# EAGLE design Adafruit I2C FRAM (EAGLE 6.3)
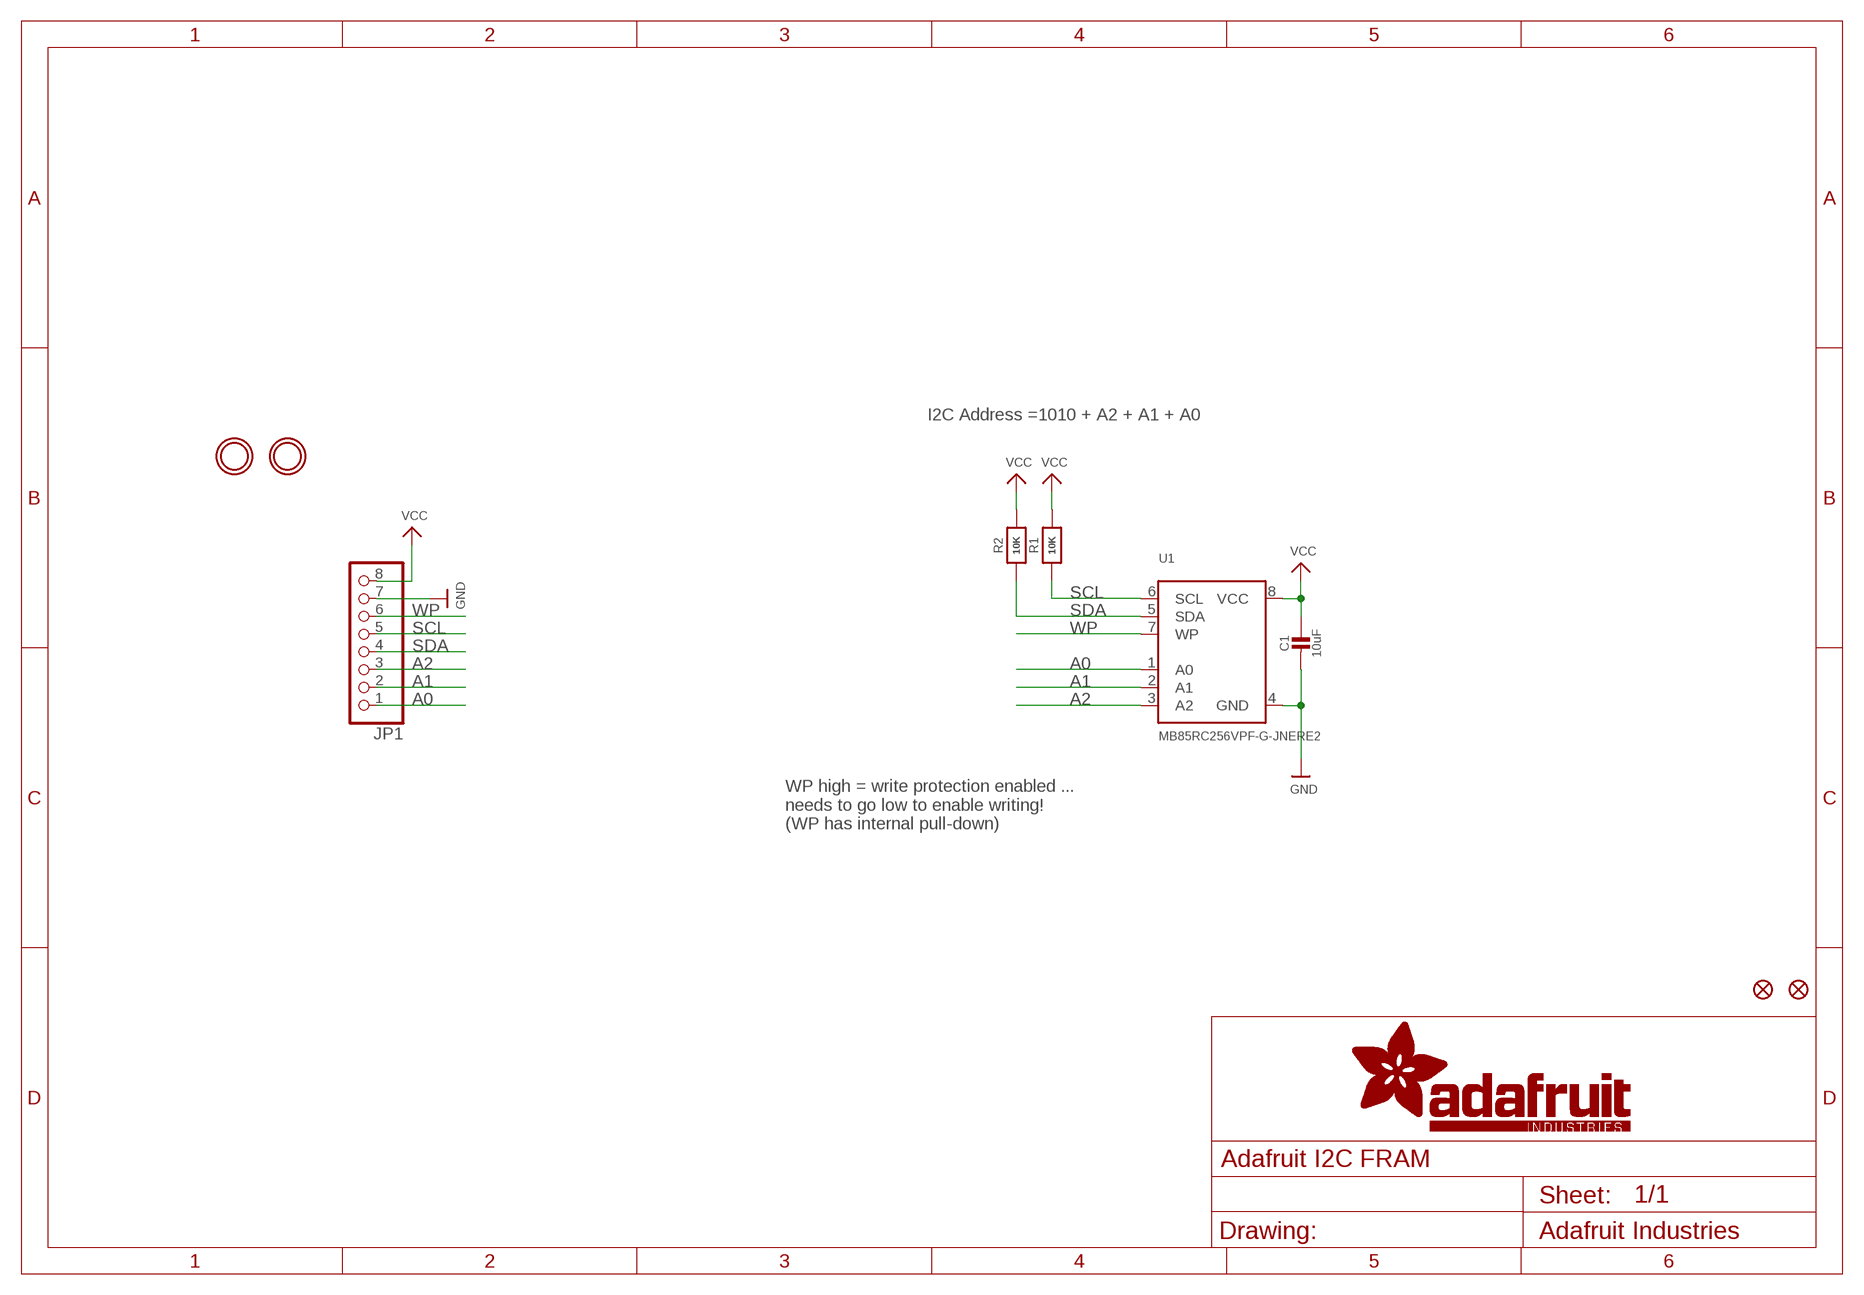
[diagram p0: schematic, sheet 1]

## Parts
C1  10uF  CAP_CERAMIC_0805MP  [_0805MP]
FID1  FIDUCIAL""  [FIDUCIAL_1MM]
FID2  FIDUCIAL""  [FIDUCIAL_1MM]
JP1  HEADER-1X870MIL  [1X08_ROUND_70]
R1  10K  RESISTOR_0805MP  [_0805MP]
R2  10K  RESISTOR_0805MP  [_0805MP]
U1  MB85RC256VPF-G-JNERE2  FRAM_SOIC8_I2C  [SOIC8_208MIL]
U$5  MOUNTINGHOLE2.5  [MOUNTINGHOLE_2.5_PLATED]
U$6  MOUNTINGHOLE2.5  [MOUNTINGHOLE_2.5_PLATED]

## Nets
A0: JP1.1 U1.1(A0)
A1: JP1.2 U1.2(A1)
A2: JP1.3 U1.3(A2)
GND: C1.2 JP1.7 U1.4(GND)
SCL: JP1.5 R1.1 U1.6(SCL)
SDA: JP1.4 R2.1 U1.5(SDA)
VCC: C1.1 JP1.8 R1.2 R2.2 U1.8(VCC)
WP: JP1.6 U1.7(WP)

## Notes on the sheet
- I2C Address =1010 + A2 + A1 + A0
- WP high = write protection enabled ... 
  needs to go low to enable writing!  
  (WP has internal pull-down)

## Library data of the parts
C1 = microbuilder:CAP_CERAMIC: Ceramic Capacitors For new designs, use the packages preceded by an '_' character since they are more reliable: The following footprints should be used on most boards: _0402 - Standard footprint for regular board layouts _0603 - Standard footprint for regular board layouts _0805 - Standard footprint for regular board layouts _1206 - Standard footprint for regular board layouts For extremely tight-pitch boards where space is at a premium, the following 'micro-pitch' footprints can be used (smaller pads, no silkscreen outline, etc.): _0402MP - Micro-pitch footprint for very dense/compact boards _0603MP - Micro-pitch footprint for very dense/compact boards _0805MP - Micro-pitch footprint for very dense/compact boards _1206MP - Micro-pitch footprint for very dense/compact boards
FID1 FID2 = microbuilder:FIDUCIAL: Fiducial Alignment Points Various fiducial points for machine vision alignment.; BOM: EXCLUDE
JP1 = microbuilder:HEADER-1X8: PIN HEADER
R1 R2 = microbuilder:RESISTOR: Resistors For new designs, use the packages preceded by an '_' character since they are more reliable: The following footprints should be used on most boards: _0402 - Standard footprint for regular board layouts _0603 - Standard footprint for regular board layouts _0805 - Standard footprint for regular board layouts _1206 - Standard footprint for regular board layouts For extremely tight-pitch boards where space is at a premium, the following 'micro-pitch' footprints can be used (smaller pads, no silkscreen outline, etc.): _0402MP - Micro-pitch footprint for very dense/compact boards _0603MP - Micro-pitch footprint for very dense/compact boards _0805MP - Micro-pitch footprint for very dense/compact boards _1206MP - Micro-pitch footprint for very dense/compact boards
U1 = microbuilder:FRAM_SOIC8_I2C: I2C FRAM - SOIC8 Package 256KBit (32Kx8) - MB85RC256VPF-G-JNERE2 - SOIC-8 200 Mil, 2.7-5.5V, -40°C-85°C
U$5 U$6 = microbuilder:MOUNTINGHOLE: Mounting Hole For #2 screws (0.086"/2.18mm width, 0.094"/2.4mm hole) use 2.5mm; BOM: EXCLUDE

## Board
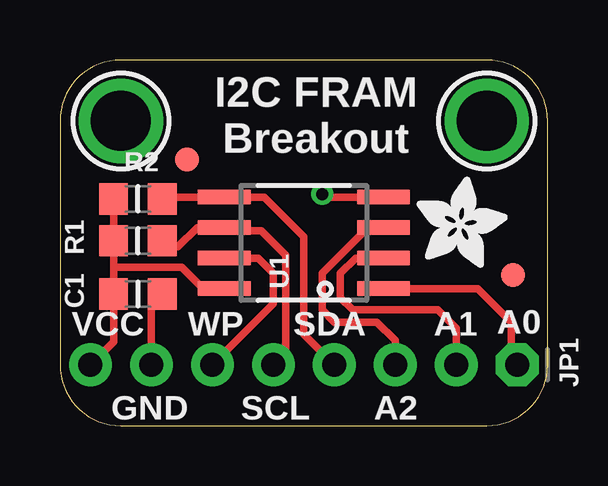
[diagram p1: board, top side]
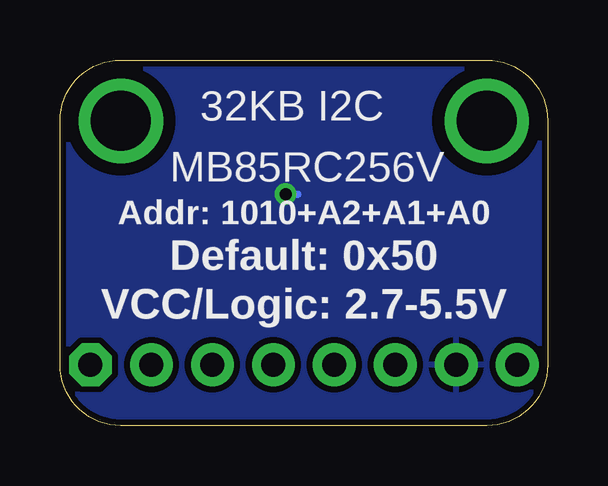
[diagram p2: board, bottom side, seen from below]

Size 20.32 x 15.24 mm. Coordinates in mm from the lower left corner, seen from the top.
Outline: 0,12.7 0,2.54 arc90 2.54,0 17.78,0 arc90 20.32,2.54 20.32,12.7 arc90 17.78,15.24 2.54,15.24 arc90 0,12.7
Copper layers (1*16): Top 0.035mm / dielectric 1.5mm / Bottom 0.035mm
Design rules "adafruit": minimum track width 8mil, minimum drill 15.5mil, track to track 8mil, track to pad 8mil, pad to pad 8mil, via to via 8mil, smd to smd 8mil, copper to edge 10mil, drill to drill 8mil, minimum pad ring 10mil, minimum via ring 8mil, stop-mask expansion 4mil, vias tented up to drill 20mil, thermal gap 10mil

### Footprints (pad centres in the part's own frame; a part is rotated, then mirrored left to right if it is on the bottom)
_0805MP = smd 1.2 x 1.3: 1 -1.016,0; 2 1.016,0
FIDUCIAL_1MM = smd 1 x 1: 1 0,0
1X08_ROUND_70 = drill 1 pad 1.778 octagon: 1 -8.89,0 | drill 1 pad 1.778: 2 -6.35,0; 3 -3.81,0; 4 -1.27,0; 5 1.27,0; 6 3.81,0; 7 6.35,0; 8 8.89,0
SOIC8_208MIL = smd 0.6 x 2.2: 1 -1.905,-3.315; 2 -0.635,-3.315; 3 0.635,-3.315; 4 1.905,-3.315; 5 1.905,3.315; 6 0.635,3.315; 7 -0.635,3.315; 8 -1.905,3.315
MOUNTINGHOLE_2.5_PLATED = drill 2.5 pad 3.2: P$1 0,0

### Placement (x,y rotation side)
C1  3.25,5.49 0 top
FID1  5.29,11.1 0 top
FID2  18.88,6.28 0 top
JP1  10.16,2.54 180 top
R1  3.25,7.71 180 top
R2  3.25,9.45 180 top
U1  10.16,7.62 90 top
U$4  [ADAFRUIT_3.5MM]  14.85,6.57 0 top
U$5  2.54,12.7 0 top
U$6  17.78,12.7 0 top

### Tracks (layer width: path | path; a pad name or v marks a point on that pad's centre or on a via)
A0
  Top 0.305: U1.1 17.4,5.71 18.8,4.32 18.8,2.79 JP1.1
A1
  Top 0.305: U1.2 12.32,6.99 11.68,6.35 11.68,5.33 12.19,4.83 15.75,4.83 16.51,4.06 JP1.2
A2
  Top 0.305: U1.3 12.83,8.26 10.92,6.35 10.92,4.83 11.43,4.32 13.21,4.32 13.97,3.56 JP1.3
GND  (via drill 0.5)
  Top 0.305: C1.2 3.81,5.04 JP1.7 | U1.4 11.05,9.53 v10.92,9.65
  Bottom 0.305: v10.92,9.65 10.41,9.65
  pour Bottom (isolate 0.254): 0,16.27 20.21,16.27 20.21,0 0,0
SCL
  Top 0.305: R1.1 4.91,7.45 5.71,8.26 U1.6 6.97,8.13 8.38,8.13 9.4,7.11 9.4,3.05 JP1.5
SDA
  Top 0.305: R2.1 4.26,9.53 U1.5 8.51,9.53 10.16,7.87 10.16,3.81 JP1.4
VCC
  Top 0.305: R2.2 R1.2 2.23,6.6 | 2.23,6.6 C1.1 2.23,3.5 JP1.8 | U1.8 5.97,5.71 5.08,6.6 2.23,6.6
WP
  Top 0.305: JP1.6 8.89,5.08 8.89,6.35 8.26,6.99 U1.7

### Text on the board
tPlace: I2C FRAM / Breakout | VCC | WP | SDA | A1 | A0 | GND | SCL | A2
bPlace: 32KB I2C | MB85RC256V | Addr: 1010+A2+A1+A0 | Default: 0x50 | VCC/Logic: 2.7-5.5V